# Altium schematic sheet 04_GAP9_CHIP_MEM.SchDoc: GAP9Shield
size A3; DrawnBy: Hanna Müller and Victor Kartsch; Organization: Integrated Systems Laboratory; DocumentNumber: 4; Revision: v1.0; SheetNumber: 4; SheetTotal: 9
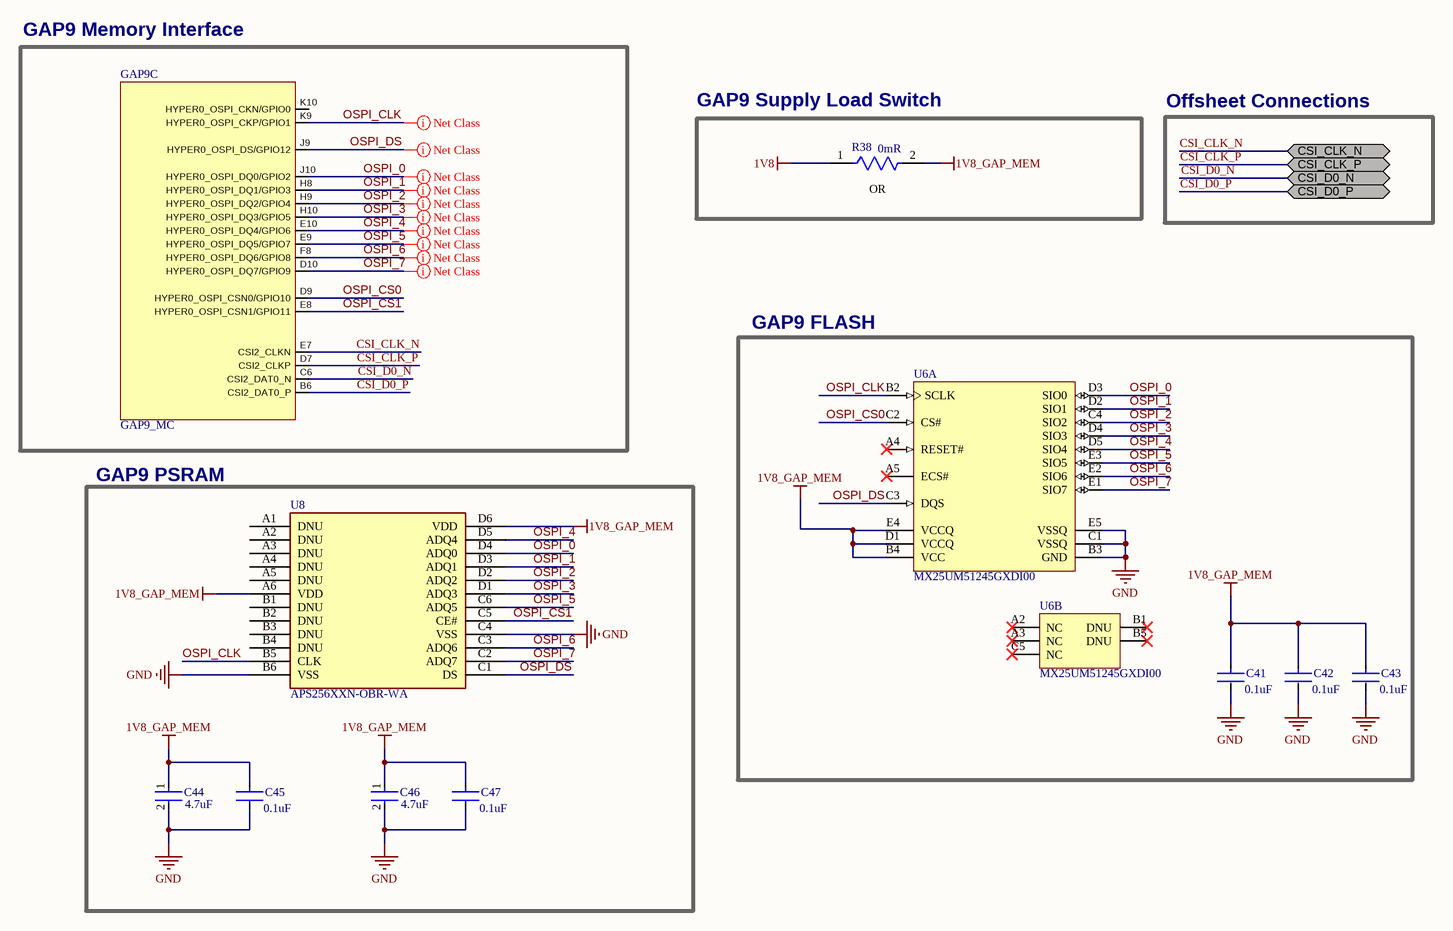
[diagram p0: 04_GAP9_CHIP_MEM.SchDoc]

## Parts
C41  Capacitance: 0.1uF  [FP-GRM033-0_03-IPC_B]  (hidden comment: GRM033Z71C104KE14D)
C42  Capacitance: 0.1uF  [FP-GRM033-0_03-IPC_B]  (hidden comment: GRM033Z71C104KE14D)
C43  Capacitance: 0.1uF  [FP-GRM033-0_03-IPC_B]  (hidden comment: GRM033Z71C104KE14D)
C44  Capacitance: 4.7uF  [FP-GRM035-0_09-IPC_B]  (hidden comment: GRM035R60J475ME15D)
C45  Capacitance: 0.1uF  [FP-GRM033-0_03-IPC_B]  (hidden comment: GRM033Z71C104KE14D)
C46  Capacitance: 4.7uF  [FP-GRM035-0_09-IPC_B]  (hidden comment: GRM035R60J475ME15D)
C47  Capacitance: 0.1uF  [FP-GRM033-0_03-IPC_B]  (hidden comment: GRM033Z71C104KE14D)
GAP9  GAP9_MC  [GAP9]  (part C of 5)
R38  value 0mR  [FP-CRCW0402-e3-IPC_C]  (hidden comment: CRCW04020000Z0ED)
U6  MX25UM51245GXDI00  [FBGA24_A-130]  (parts A,B of 2)
U8  APS256XXN-OBR-WA  [WLCSP24]

## Blocks framed on the sheet
GAP9 Memory Interface: GAP9
GAP9 Supply Load Switch: R38
GAP9 FLASH: C41-C43 U6
GAP9 PSRAM: C44-C47 U8

## Ports
CSI_CLK_N (bidir), CSI_CLK_P (bidir), CSI_D0_N (bidir), CSI_D0_P (bidir)

## Nets
1V8: R38.1
1V8_GAP_MEM: C41.1 C42.1 C43.1 C44.1 C45.1 C46.1 C47.1 R38.2 U6.B4(VCC) U6.D1(VCCQ) U6.E4(VCCQ) U8.A6(VDD) U8.D6(VDD)
GND: C41.2 C42.2 C43.2 C44.2 C45.2 C46.2 C47.2 U6.B3(GND) U6.C1(VSSQ) U6.E5(VSSQ) U8.B6(VSS) U8.C4(VSS)
CSI_CLK_N: GAP9.E7(CSI2_CLKN) ; port CSI_CLK_N
CSI_CLK_P: GAP9.D7(CSI2_CLKP) ; port CSI_CLK_P
CSI_D0_N: GAP9.C6(CSI2_DAT0_N) ; port CSI_D0_N
CSI_D0_P: GAP9.B6(CSI2_DAT0_P) ; port CSI_D0_P
OSPI_0: GAP9.J10(HYPER0_OSPI_DQ0/GPIO2) U6.D3(SIO0) U8.D4(ADQ0)
OSPI_1: GAP9.H8(HYPER0_OSPI_DQ1/GPIO3) U6.D2(SIO1) U8.D3(ADQ1)
OSPI_2: GAP9.H9(HYPER0_OSPI_DQ2/GPIO4) U6.C4(SIO2) U8.D2(ADQ2)
OSPI_3: GAP9.H10(HYPER0_OSPI_DQ3/GPIO5) U6.D4(SIO3) U8.D1(ADQ3)
OSPI_4: GAP9.E10(HYPER0_OSPI_DQ4/GPIO6) U6.D5(SIO4) U8.D5(ADQ4)
OSPI_5: GAP9.E9(HYPER0_OSPI_DQ5/GPIO7) U6.E3(SIO5) U8.C6(ADQ5)
OSPI_6: GAP9.F8(HYPER0_OSPI_DQ6/GPIO8) U6.E2(SIO6) U8.C3(ADQ6)
OSPI_7: GAP9.D10(HYPER0_OSPI_DQ7/GPIO9) U6.E1(SIO7) U8.C2(ADQ7)
OSPI_CLK: GAP9.K9(HYPER0_OSPI_CKP/GPIO1) U6.B2(SCLK) U8.B5(CLK)
OSPI_CS0: GAP9.D9(HYPER0_OSPI_CSN0/GPIO10) U6.C2(CS#)
OSPI_CS1: GAP9.E8(HYPER0_OSPI_CSN1/GPIO11) U8.C5(CE#)
OSPI_DS: GAP9.J9(HYPER0_OSPI_DS/GPIO12) U6.C3(DQS) U8.C1(DS)

Not connected (* = marked no-connect by the designer): GAP9 K10(HYPER0_OSPI_CKN/GPIO0); U6 A2(NC)* A3(NC)* A4(RESET#)* A5(ECS#)* B1(DNU)* B5(DNU)* C5(NC)*; U8 A1(DNU) A2(DNU) A3(DNU) A4(DNU) A5(DNU) B1(DNU) B2(DNU) B3(DNU) B4(DNU)

## Layout directives
net class MEMORIES: OSPI_0, OSPI_1, OSPI_2, OSPI_3, OSPI_4, OSPI_5, OSPI_6, OSPI_7, OSPI_CLK, OSPI_DS

## Notes on the sheet
- Offsheet Connections
- (near R38) OR
- 1
- 2
- 3
- 4
- 5
- 6
- 7
- 8
- A
- B
- C
- D
- Project:
- Date:
- Drawing number:
- Rev:
- Format:
- A3
- Drawn by:
- Laboratory:
- Page
- Sheet:
- of
- File:

## Library data of the parts
C41-C43 C45 C47 = CMP-06035-035508-1: Chip Multilayer Ceramic Capacitors for General Purpose, 0201, 0.10uF, X7R, 15%, 10%, 16V; value: 0.1uF; Case/Package: 0201
C44 C46 = CMP-06035-019701-1: Chip Multilayer Ceramic Capacitors for General Purpose, 0201, 4.7uF, X5R, 15%, 20%, 6.3V; Max Operating Temperature: 85°C; Packaging: Tape and Reel; Voltage Rating: 6.3V; Min Operating Temperature: -55°C; Case/Package: 0201; Voltage Rating (DC): 6.3V; Tolerance: 20%; Length: 0.024inch; Dielectric: X5R; Case Code (Imperial): 0201; Case Code (Metric): 0603; Width: 0.012inch; Mount: Surface Mount; Thickness: 0.022inch; value: 4.7uF
R38 = CMP-2002-08122-2: RES Thick Film, 0Ω, 0.063W, 0402; Tolerance: 5%; Max Power Dissipation: 63mW; Voltage Rating: 50V; Temperature Coefficient: 100ppm/°C; Contact Plating: Tin; Height: 0.35mm; Radiation Hardening: No; Features: Automotive AEC-Q200; Composition: Thick Film; Width: 0.5mm; Weight: 2.3E-05oz; Termination: SMD/SMT; Packaging: Tape and Reel; Mount: Surface Mount; Case Code (Metric): 1005; Military Standard: Not; Min Operating Temperature: -55°C; Number of Terminations: 2; Package Quantity: 1; Case Code (Imperial): 0402; Depth: 0.5mm; Max Operating Temperature: 155°C; Case/Package: 0402; Resistance: 0mR; Power Rating: 63mW; Lead Free: Lead Free; Voltage Rating (DC): 50V; Length: 1mm
U6 = CMP-02792-1: NOR Flash Memory 512Mb 1.8V Octa I/O Serial 24-Pin BGA; Mfr: Macronix; Memory Type: Non-Volatile; Memory Size: 512Mbit; Memory Organization: 64M x 8; Memory Interface: SPI - Quad I/O, DTR; Clock Frequency: 200 MHz; Write Cycle Time - Word, Page: 60µs, 750µs; Voltage - Supply: 1.65V ~ 2V; Series: MXSMIO™; Digi-Key Programmable: Not Verified; Memory Format: FLASH; Technology: FLASH - NOR; Operating Temperature: -40°C ~ 85°C (TA); Mounting Type: Surface Mount; Package / Case: 24-TBGA; Supplier Device Package: 24-CSPBGA (6x8); Base Product Number: MX25UM51245
U8 = APS256XXN-OBR: No Description Available; Mfr_Name: AP Memory; Manufacturer_Part_Number: APS256XXN-OBR-BG; Copyright: Copyright (C) 2022 Ultra Librarian. All rights reserved.; RefDes: RefDes; Type: DEV